# Altium schematic sheet USB.SchDoc
size A4; SheetNumber: 4; SheetTotal: 10
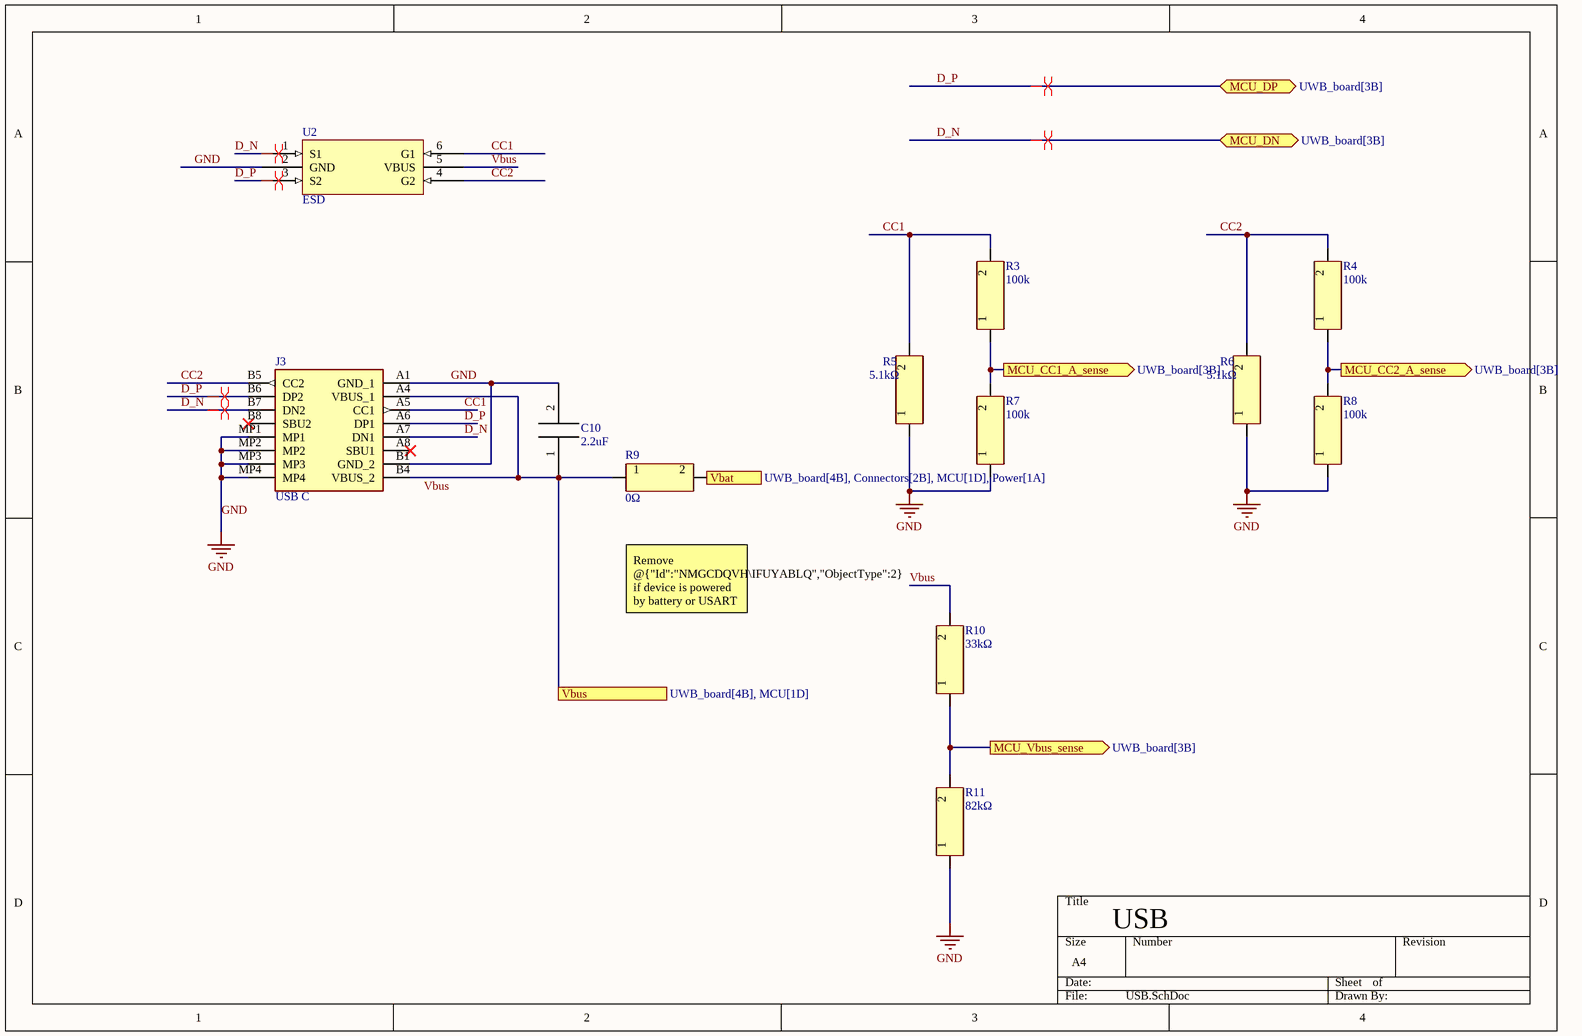
[diagram p0: USB.SchDoc]

## Parts
C10  2.2uF  [0603_cap]
J3  USB C  [UJ20CHGSMT5P16TR]
R3  100k  [0603_res]
R4  100k  [0603_res]
R5  value 5.1kΩ  [0603_res]  (hidden comment: 5.1k)
R6  value 5.1kΩ  [0603_res]  (hidden comment: 5.1k)
R7  100k  [0603_res]
R8  100k  [0603_res]
R9  value 0Ω  [0603_res]  (hidden comment: 0R)
R10  value 33kΩ  [0603_res]  (hidden comment: 33k)
R11  value 82kΩ  [0603_res]  (hidden comment: 82k)
U2  ESD  [sot-23-6L_ESD]

## Ports
MCU_CC1_A_sense (out, see UWB_board[3B]), MCU_CC2_A_sense (out, see UWB_board[3B]), MCU_DN (bidir, see UWB_board[3B]), MCU_DP (bidir, see UWB_board[3B]), MCU_Vbus_sense (out, see UWB_board[3B]), Vbat (out, see UWB_board[4B], Connectors[2B], MCU[1D], Power[1A]), Vbus (see UWB_board[4B], MCU[1D])

## Nets
GND: C10.2 J3.A1(GND_1) J3.B1(GND_2) J3.MP1 J3.MP2 J3.MP3 J3.MP4 R5.1 R6.1 R7.1 R8.1 R11.1 U2.2(GND)
CC1: J3.A5(CC1) R3.2 R5.2 U2.6(G1)
CC2: J3.B5(CC2) R4.2 R6.2 U2.4(G2)
D_N: J3.A7(DN1) J3.B7(DN2) U2.1(S1) ; port MCU_DN
D_P: J3.A6(DP1) J3.B6(DP2) U2.3(S2) ; port MCU_DP
MCU_CC1_A_sense: R3.1 R7.2 ; port MCU_CC1_A_sense
MCU_CC2_A_sense: R4.1 R8.2 ; port MCU_CC2_A_sense
MCU_Vbus_sense: R10.1 R11.2 ; port MCU_Vbus_sense
Vbat: R9.2 ; port Vbat
Vbus: C10.1 J3.A4(VBUS_1) J3.B4(VBUS_2) R9.1 R10.2 U2.5(VBUS) ; port Vbus

Not connected (* = marked no-connect by the designer): J3 A8(SBU1)* B8(SBU2)*

## Layout directives
differential pair; Impedance: 90 +-15%: D_N, D_P
differential pair: D_N

## Notes on the sheet
- Remove @{"Id":"NMGCDQVH\IFUYABLQ","ObjectType":2} if device is powered by battery or USART
- USB

## Library data of the parts
C10 = CL10A225KO8NNNC: 2.2uF 16V X5R ±10% 0603 Multilayer Ceramic Capacitors MLCC - SMD/SMT ROHS; LCSC Part #: C23630; Value: 2.2uF
J3 = UJ20-C-H-G-SMT-5-P16-TR: Type C, USB 2.0, 480 Mbps, 48 Vac, 5 A, Horizontal, Gold Plated 3u, Surface Mount with post, 16 pin, USB Receptacle; Mouser Part Number: 179-UJ20CHGSMT5P16TR; LCSC Part #: C22383469
R3 R4 R7 R8 = 0603WAF1003T5E: 100kΩ -55℃~+155℃ 100kΩ 100mW 75V Thick Film Resistor ±1% ±100ppm/℃ 0603 Chip Resistor - Surface Mount ROHS; LCSC Part #: C25803; Value: 100k
R5 R6 = 0603WAF5101T5E: 5.1kΩ -55℃~+155℃ 100mW 75V Thick Film Resistor ±1% ±100ppm/℃ 0603 Chip Resistor - Surface Mount ROHS; LCSC Part #: C23186
R9 = 0603WAF0000T5E: 0Ω -55℃~+155℃ 100mW 75V Thick Film Resistor ±1% ±100ppm/℃ 0603 Chip Resistor - Surface Mount ROHS; LCSC Part #: C21189
R10 = 0603WAF3302T5E: 33kΩ -55℃~+155℃ 100mW 75V Thick Film Resistor ±1% ±100ppm/℃ 0603 Chip Resistor - Surface Mount ROHS; LCSC Part #: C4216
R11 = 0603WAF8202T5E: 82kΩ -55℃~+155℃ 100mW 75V Thick Film Resistor ±1% ±100ppm/℃ 0603 Chip Resistor - Surface Mount ROHS; LCSC Part #: C23254
U2 = SRV05-4: -55℃~+155℃ 12.5V 1pF 5 5A 5V 5uA 6V 75W ESD IEC 61000-4-2 Unidirectional SOT-23-6L ESD and Surge Protection (TVS/ESD) ROHS; LCSC Part #: C7420376